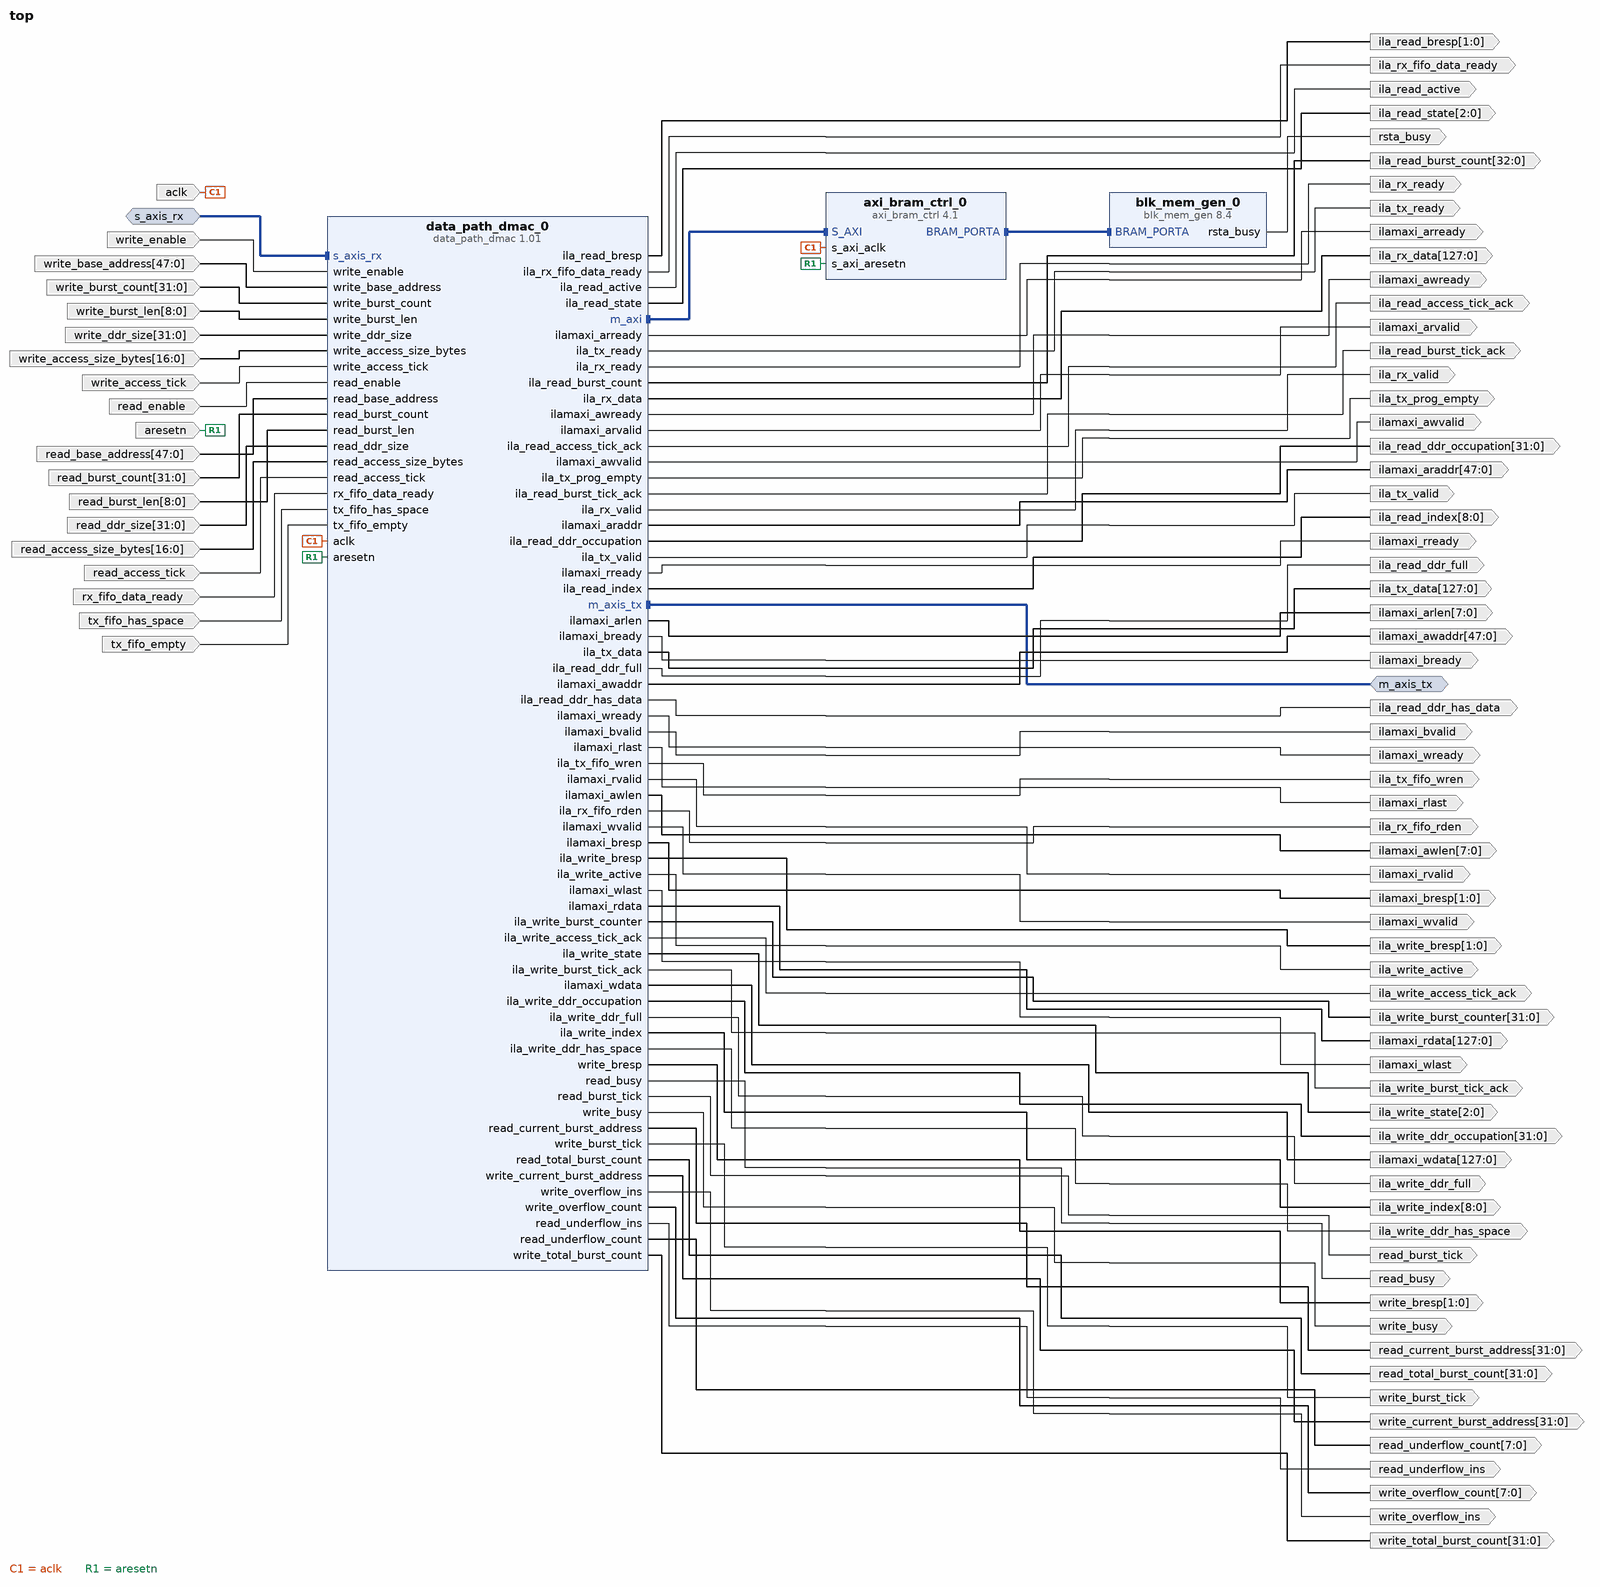
[diagram p0: block diagram of the top level]
# Vivado block design top, xczu3cg-sfvc784-1-e, Vivado 2020.2.2
create_bd_design top

create_bd_intf_port -mode Master -vlnv xilinx.com:interface:axis_rtl:1.0 m_axis_tx
set_property -dict {CONFIG.FREQ_HZ 200000000} [get_bd_intf_ports m_axis_tx]
create_bd_intf_port -mode Slave -vlnv xilinx.com:interface:axis_rtl:1.0 s_axis_rx
set_property -dict [list \
  CONFIG.FREQ_HZ 200000000 \
  CONFIG.HAS_TKEEP 0 \
  CONFIG.HAS_TLAST 0 \
  CONFIG.HAS_TREADY 1 \
  CONFIG.HAS_TSTRB 0 \
  CONFIG.LAYERED_METADATA undef \
  CONFIG.TDATA_NUM_BYTES 16 \
  CONFIG.TDEST_WIDTH 0 \
  CONFIG.TID_WIDTH 0 \
  CONFIG.TUSER_WIDTH 0 \
] [get_bd_intf_ports s_axis_rx]
create_bd_port -dir I -type clk aclk
set_property -dict {CONFIG.FREQ_HZ 200000000} [get_bd_ports aclk]
create_bd_port -dir I -type rst aresetn
create_bd_port -dir O rsta_busy
create_bd_port -dir I write_enable
create_bd_port -dir I -from 47 -to 0 write_base_address
create_bd_port -dir I -from 31 -to 0 write_burst_count
create_bd_port -dir I -from 8 -to 0 write_burst_len
create_bd_port -dir I -from 31 -to 0 write_ddr_size
create_bd_port -dir I -from 16 -to 0 write_access_size_bytes
create_bd_port -dir I write_access_tick
create_bd_port -dir I read_enable
create_bd_port -dir I -from 47 -to 0 read_base_address
create_bd_port -dir I -from 31 -to 0 read_burst_count
create_bd_port -dir I -from 8 -to 0 read_burst_len
create_bd_port -dir I -from 31 -to 0 read_ddr_size
create_bd_port -dir I -from 16 -to 0 read_access_size_bytes
create_bd_port -dir I read_access_tick
create_bd_port -dir I rx_fifo_data_ready
create_bd_port -dir I tx_fifo_has_space
create_bd_port -dir I tx_fifo_empty
create_bd_port -dir O ilamaxi_awready
create_bd_port -dir O ilamaxi_awvalid
create_bd_port -dir O ilamaxi_wready
create_bd_port -dir O ilamaxi_wvalid
create_bd_port -dir O ilamaxi_arready
create_bd_port -dir O ilamaxi_arvalid
create_bd_port -dir O ilamaxi_rready
create_bd_port -dir O ilamaxi_rvalid
create_bd_port -dir O ilamaxi_rlast
create_bd_port -dir O ilamaxi_wlast
create_bd_port -dir O ilamaxi_bvalid
create_bd_port -dir O ilamaxi_bready
create_bd_port -dir O -from 1 -to 0 ilamaxi_bresp
create_bd_port -dir O -from 47 -to 0 ilamaxi_araddr
create_bd_port -dir O -from 47 -to 0 ilamaxi_awaddr
create_bd_port -dir O -from 7 -to 0 ilamaxi_arlen
create_bd_port -dir O -from 7 -to 0 ilamaxi_awlen
create_bd_port -dir O -from 127 -to 0 ilamaxi_rdata
create_bd_port -dir O -from 127 -to 0 ilamaxi_wdata
create_bd_port -dir O ila_tx_ready
create_bd_port -dir O ila_tx_valid
create_bd_port -dir O ila_tx_prog_empty
create_bd_port -dir O ila_rx_ready
create_bd_port -dir O ila_rx_valid
create_bd_port -dir O ila_rx_fifo_data_ready
create_bd_port -dir O -from 127 -to 0 ila_tx_data
create_bd_port -dir O -from 127 -to 0 ila_rx_data
create_bd_port -dir O -from 2 -to 0 ila_read_state
create_bd_port -dir O -from 1 -to 0 ila_read_bresp
create_bd_port -dir O ila_tx_fifo_wren
create_bd_port -dir O ila_read_active
create_bd_port -dir O -from 32 -to 0 ila_read_burst_count
create_bd_port -dir O -from 8 -to 0 ila_read_index
create_bd_port -dir O -from 31 -to 0 ila_read_ddr_occupation
create_bd_port -dir O ila_read_burst_tick_ack
create_bd_port -dir O ila_read_access_tick_ack
create_bd_port -dir O ila_read_ddr_has_data
create_bd_port -dir O ila_read_ddr_full
create_bd_port -dir O -from 2 -to 0 ila_write_state
create_bd_port -dir O -from 1 -to 0 ila_write_bresp
create_bd_port -dir O ila_rx_fifo_rden
create_bd_port -dir O ila_write_active
create_bd_port -dir O -from 31 -to 0 ila_write_burst_counter
create_bd_port -dir O -from 8 -to 0 ila_write_index
create_bd_port -dir O -from 31 -to 0 ila_write_ddr_occupation
create_bd_port -dir O ila_write_burst_tick_ack
create_bd_port -dir O ila_write_access_tick_ack
create_bd_port -dir O ila_write_ddr_has_space
create_bd_port -dir O ila_write_ddr_full
create_bd_port -dir O write_busy
create_bd_port -dir O -from 1 -to 0 write_bresp
create_bd_port -dir O write_burst_tick
create_bd_port -dir O -from 31 -to 0 write_total_burst_count
create_bd_port -dir O -from 31 -to 0 write_current_burst_address
create_bd_port -dir O write_overflow_ins
create_bd_port -dir O -from 7 -to 0 write_overflow_count
create_bd_port -dir O read_busy
create_bd_port -dir O read_burst_tick
create_bd_port -dir O -from 31 -to 0 read_total_burst_count
create_bd_port -dir O -from 31 -to 0 read_current_burst_address
create_bd_port -dir O read_underflow_ins
create_bd_port -dir O -from 7 -to 0 read_underflow_count

create_bd_cell -type ip -vlnv xilinx.com:ip:axi_bram_ctrl:4.1 axi_bram_ctrl_0
set_property -dict {CONFIG.DATA_WIDTH 128 CONFIG.SINGLE_PORT_BRAM 1} [get_bd_cells axi_bram_ctrl_0]
create_bd_cell -type ip -vlnv xilinx.com:ip:blk_mem_gen:8.4 blk_mem_gen_0
set_property -dict [list \
  CONFIG.EN_SAFETY_CKT true \
  CONFIG.Enable_32bit_Address true \
  CONFIG.Read_Width_A 128 \
  CONFIG.Register_PortA_Output_of_Memory_Primitives false \
  CONFIG.Use_RSTA_Pin true \
  CONFIG.Write_Width_A 128 \
  CONFIG.use_bram_block BRAM_Controller \
] [get_bd_cells blk_mem_gen_0]
create_bd_cell -type ip -vlnv merckgroup.com:user:data_path_dmac:1.01 data_path_dmac_0

# ---- connections ----

connect_bd_intf_net [get_bd_intf_pins axi_bram_ctrl_0/BRAM_PORTA] [get_bd_intf_pins blk_mem_gen_0/BRAM_PORTA]
connect_bd_intf_net [get_bd_intf_pins axi_bram_ctrl_0/S_AXI] [get_bd_intf_pins data_path_dmac_0/m_axi]
connect_bd_intf_net [get_bd_intf_ports s_axis_rx] [get_bd_intf_pins data_path_dmac_0/s_axis_rx]
connect_bd_intf_net [get_bd_intf_ports m_axis_tx] [get_bd_intf_pins data_path_dmac_0/m_axis_tx]
connect_bd_net [get_bd_ports aclk] [get_bd_pins axi_bram_ctrl_0/s_axi_aclk] [get_bd_pins data_path_dmac_0/aclk]
connect_bd_net [get_bd_ports aresetn] [get_bd_pins axi_bram_ctrl_0/s_axi_aresetn] [get_bd_pins data_path_dmac_0/aresetn]
connect_bd_net [get_bd_pins blk_mem_gen_0/rsta_busy] [get_bd_ports rsta_busy]
connect_bd_net [get_bd_ports write_enable] [get_bd_pins data_path_dmac_0/write_enable]
connect_bd_net [get_bd_ports write_base_address] [get_bd_pins data_path_dmac_0/write_base_address]
connect_bd_net [get_bd_ports write_burst_count] [get_bd_pins data_path_dmac_0/write_burst_count]
connect_bd_net [get_bd_ports write_burst_len] [get_bd_pins data_path_dmac_0/write_burst_len]
connect_bd_net [get_bd_ports write_ddr_size] [get_bd_pins data_path_dmac_0/write_ddr_size]
connect_bd_net [get_bd_ports write_access_size_bytes] [get_bd_pins data_path_dmac_0/write_access_size_bytes]
connect_bd_net [get_bd_ports write_access_tick] [get_bd_pins data_path_dmac_0/write_access_tick]
connect_bd_net [get_bd_ports read_enable] [get_bd_pins data_path_dmac_0/read_enable]
connect_bd_net [get_bd_ports read_base_address] [get_bd_pins data_path_dmac_0/read_base_address]
connect_bd_net [get_bd_ports read_burst_count] [get_bd_pins data_path_dmac_0/read_burst_count]
connect_bd_net [get_bd_ports read_burst_len] [get_bd_pins data_path_dmac_0/read_burst_len]
connect_bd_net [get_bd_ports read_ddr_size] [get_bd_pins data_path_dmac_0/read_ddr_size]
connect_bd_net [get_bd_ports read_access_size_bytes] [get_bd_pins data_path_dmac_0/read_access_size_bytes]
connect_bd_net [get_bd_ports read_access_tick] [get_bd_pins data_path_dmac_0/read_access_tick]
connect_bd_net [get_bd_ports rx_fifo_data_ready] [get_bd_pins data_path_dmac_0/rx_fifo_data_ready]
connect_bd_net [get_bd_ports tx_fifo_has_space] [get_bd_pins data_path_dmac_0/tx_fifo_has_space]
connect_bd_net [get_bd_ports tx_fifo_empty] [get_bd_pins data_path_dmac_0/tx_fifo_empty]
connect_bd_net [get_bd_pins data_path_dmac_0/ilamaxi_awready] [get_bd_ports ilamaxi_awready]
connect_bd_net [get_bd_pins data_path_dmac_0/ilamaxi_awvalid] [get_bd_ports ilamaxi_awvalid]
connect_bd_net [get_bd_pins data_path_dmac_0/ilamaxi_wready] [get_bd_ports ilamaxi_wready]
connect_bd_net [get_bd_pins data_path_dmac_0/ilamaxi_wvalid] [get_bd_ports ilamaxi_wvalid]
connect_bd_net [get_bd_pins data_path_dmac_0/ilamaxi_arready] [get_bd_ports ilamaxi_arready]
connect_bd_net [get_bd_pins data_path_dmac_0/ilamaxi_arvalid] [get_bd_ports ilamaxi_arvalid]
connect_bd_net [get_bd_pins data_path_dmac_0/ilamaxi_rready] [get_bd_ports ilamaxi_rready]
connect_bd_net [get_bd_pins data_path_dmac_0/ilamaxi_rvalid] [get_bd_ports ilamaxi_rvalid]
connect_bd_net [get_bd_pins data_path_dmac_0/ilamaxi_rlast] [get_bd_ports ilamaxi_rlast]
connect_bd_net [get_bd_pins data_path_dmac_0/ilamaxi_wlast] [get_bd_ports ilamaxi_wlast]
connect_bd_net [get_bd_pins data_path_dmac_0/ilamaxi_bvalid] [get_bd_ports ilamaxi_bvalid]
connect_bd_net [get_bd_pins data_path_dmac_0/ilamaxi_bready] [get_bd_ports ilamaxi_bready]
connect_bd_net [get_bd_pins data_path_dmac_0/ilamaxi_bresp] [get_bd_ports ilamaxi_bresp]
connect_bd_net [get_bd_pins data_path_dmac_0/ilamaxi_araddr] [get_bd_ports ilamaxi_araddr]
connect_bd_net [get_bd_pins data_path_dmac_0/ilamaxi_awaddr] [get_bd_ports ilamaxi_awaddr]
connect_bd_net [get_bd_pins data_path_dmac_0/ilamaxi_arlen] [get_bd_ports ilamaxi_arlen]
connect_bd_net [get_bd_pins data_path_dmac_0/ilamaxi_awlen] [get_bd_ports ilamaxi_awlen]
connect_bd_net [get_bd_pins data_path_dmac_0/ilamaxi_rdata] [get_bd_ports ilamaxi_rdata]
connect_bd_net [get_bd_pins data_path_dmac_0/ilamaxi_wdata] [get_bd_ports ilamaxi_wdata]
connect_bd_net [get_bd_pins data_path_dmac_0/ila_tx_ready] [get_bd_ports ila_tx_ready]
connect_bd_net [get_bd_pins data_path_dmac_0/ila_tx_valid] [get_bd_ports ila_tx_valid]
connect_bd_net [get_bd_pins data_path_dmac_0/ila_tx_prog_empty] [get_bd_ports ila_tx_prog_empty]
connect_bd_net [get_bd_pins data_path_dmac_0/ila_rx_ready] [get_bd_ports ila_rx_ready]
connect_bd_net [get_bd_pins data_path_dmac_0/ila_rx_valid] [get_bd_ports ila_rx_valid]
connect_bd_net [get_bd_pins data_path_dmac_0/ila_rx_fifo_data_ready] [get_bd_ports ila_rx_fifo_data_ready]
connect_bd_net [get_bd_pins data_path_dmac_0/ila_tx_data] [get_bd_ports ila_tx_data]
connect_bd_net [get_bd_pins data_path_dmac_0/ila_rx_data] [get_bd_ports ila_rx_data]
connect_bd_net [get_bd_pins data_path_dmac_0/ila_read_state] [get_bd_ports ila_read_state]
connect_bd_net [get_bd_pins data_path_dmac_0/ila_read_bresp] [get_bd_ports ila_read_bresp]
connect_bd_net [get_bd_pins data_path_dmac_0/ila_tx_fifo_wren] [get_bd_ports ila_tx_fifo_wren]
connect_bd_net [get_bd_pins data_path_dmac_0/ila_read_active] [get_bd_ports ila_read_active]
connect_bd_net [get_bd_pins data_path_dmac_0/ila_read_burst_count] [get_bd_ports ila_read_burst_count]
connect_bd_net [get_bd_pins data_path_dmac_0/ila_read_index] [get_bd_ports ila_read_index]
connect_bd_net [get_bd_pins data_path_dmac_0/ila_read_ddr_occupation] [get_bd_ports ila_read_ddr_occupation]
connect_bd_net [get_bd_pins data_path_dmac_0/ila_read_burst_tick_ack] [get_bd_ports ila_read_burst_tick_ack]
connect_bd_net [get_bd_pins data_path_dmac_0/ila_read_access_tick_ack] [get_bd_ports ila_read_access_tick_ack]
connect_bd_net [get_bd_pins data_path_dmac_0/ila_read_ddr_has_data] [get_bd_ports ila_read_ddr_has_data]
connect_bd_net [get_bd_pins data_path_dmac_0/ila_read_ddr_full] [get_bd_ports ila_read_ddr_full]
connect_bd_net [get_bd_pins data_path_dmac_0/ila_write_state] [get_bd_ports ila_write_state]
connect_bd_net [get_bd_pins data_path_dmac_0/ila_write_bresp] [get_bd_ports ila_write_bresp]
connect_bd_net [get_bd_pins data_path_dmac_0/ila_rx_fifo_rden] [get_bd_ports ila_rx_fifo_rden]
connect_bd_net [get_bd_pins data_path_dmac_0/ila_write_active] [get_bd_ports ila_write_active]
connect_bd_net [get_bd_pins data_path_dmac_0/ila_write_burst_counter] [get_bd_ports ila_write_burst_counter]
connect_bd_net [get_bd_pins data_path_dmac_0/ila_write_index] [get_bd_ports ila_write_index]
connect_bd_net [get_bd_pins data_path_dmac_0/ila_write_ddr_occupation] [get_bd_ports ila_write_ddr_occupation]
connect_bd_net [get_bd_pins data_path_dmac_0/ila_write_burst_tick_ack] [get_bd_ports ila_write_burst_tick_ack]
connect_bd_net [get_bd_pins data_path_dmac_0/ila_write_access_tick_ack] [get_bd_ports ila_write_access_tick_ack]
connect_bd_net [get_bd_pins data_path_dmac_0/ila_write_ddr_has_space] [get_bd_ports ila_write_ddr_has_space]
connect_bd_net [get_bd_pins data_path_dmac_0/ila_write_ddr_full] [get_bd_ports ila_write_ddr_full]
connect_bd_net [get_bd_pins data_path_dmac_0/write_busy] [get_bd_ports write_busy]
connect_bd_net [get_bd_pins data_path_dmac_0/write_bresp] [get_bd_ports write_bresp]
connect_bd_net [get_bd_pins data_path_dmac_0/write_burst_tick] [get_bd_ports write_burst_tick]
connect_bd_net [get_bd_pins data_path_dmac_0/write_current_burst_address] [get_bd_ports write_current_burst_address]
connect_bd_net [get_bd_pins data_path_dmac_0/write_overflow_ins] [get_bd_ports write_overflow_ins]
connect_bd_net [get_bd_pins data_path_dmac_0/write_overflow_count] [get_bd_ports write_overflow_count]
connect_bd_net [get_bd_pins data_path_dmac_0/read_busy] [get_bd_ports read_busy]
connect_bd_net [get_bd_pins data_path_dmac_0/read_burst_tick] [get_bd_ports read_burst_tick]
connect_bd_net [get_bd_pins data_path_dmac_0/read_total_burst_count] [get_bd_ports read_total_burst_count]
connect_bd_net [get_bd_pins data_path_dmac_0/read_current_burst_address] [get_bd_ports read_current_burst_address]
connect_bd_net [get_bd_pins data_path_dmac_0/read_underflow_ins] [get_bd_ports read_underflow_ins]
connect_bd_net [get_bd_pins data_path_dmac_0/read_underflow_count] [get_bd_ports read_underflow_count]
connect_bd_net [get_bd_pins data_path_dmac_0/write_total_burst_count] [get_bd_ports write_total_burst_count]

# ---- address map ----
assign_bd_address -offset 0x0000C0000000 -range 16K -target_address_space [get_bd_addr_spaces data_path_dmac_0/m_axi] [get_bd_addr_segs axi_bram_ctrl_0/S_AXI/Mem0]

validate_bd_design
save_bd_design
